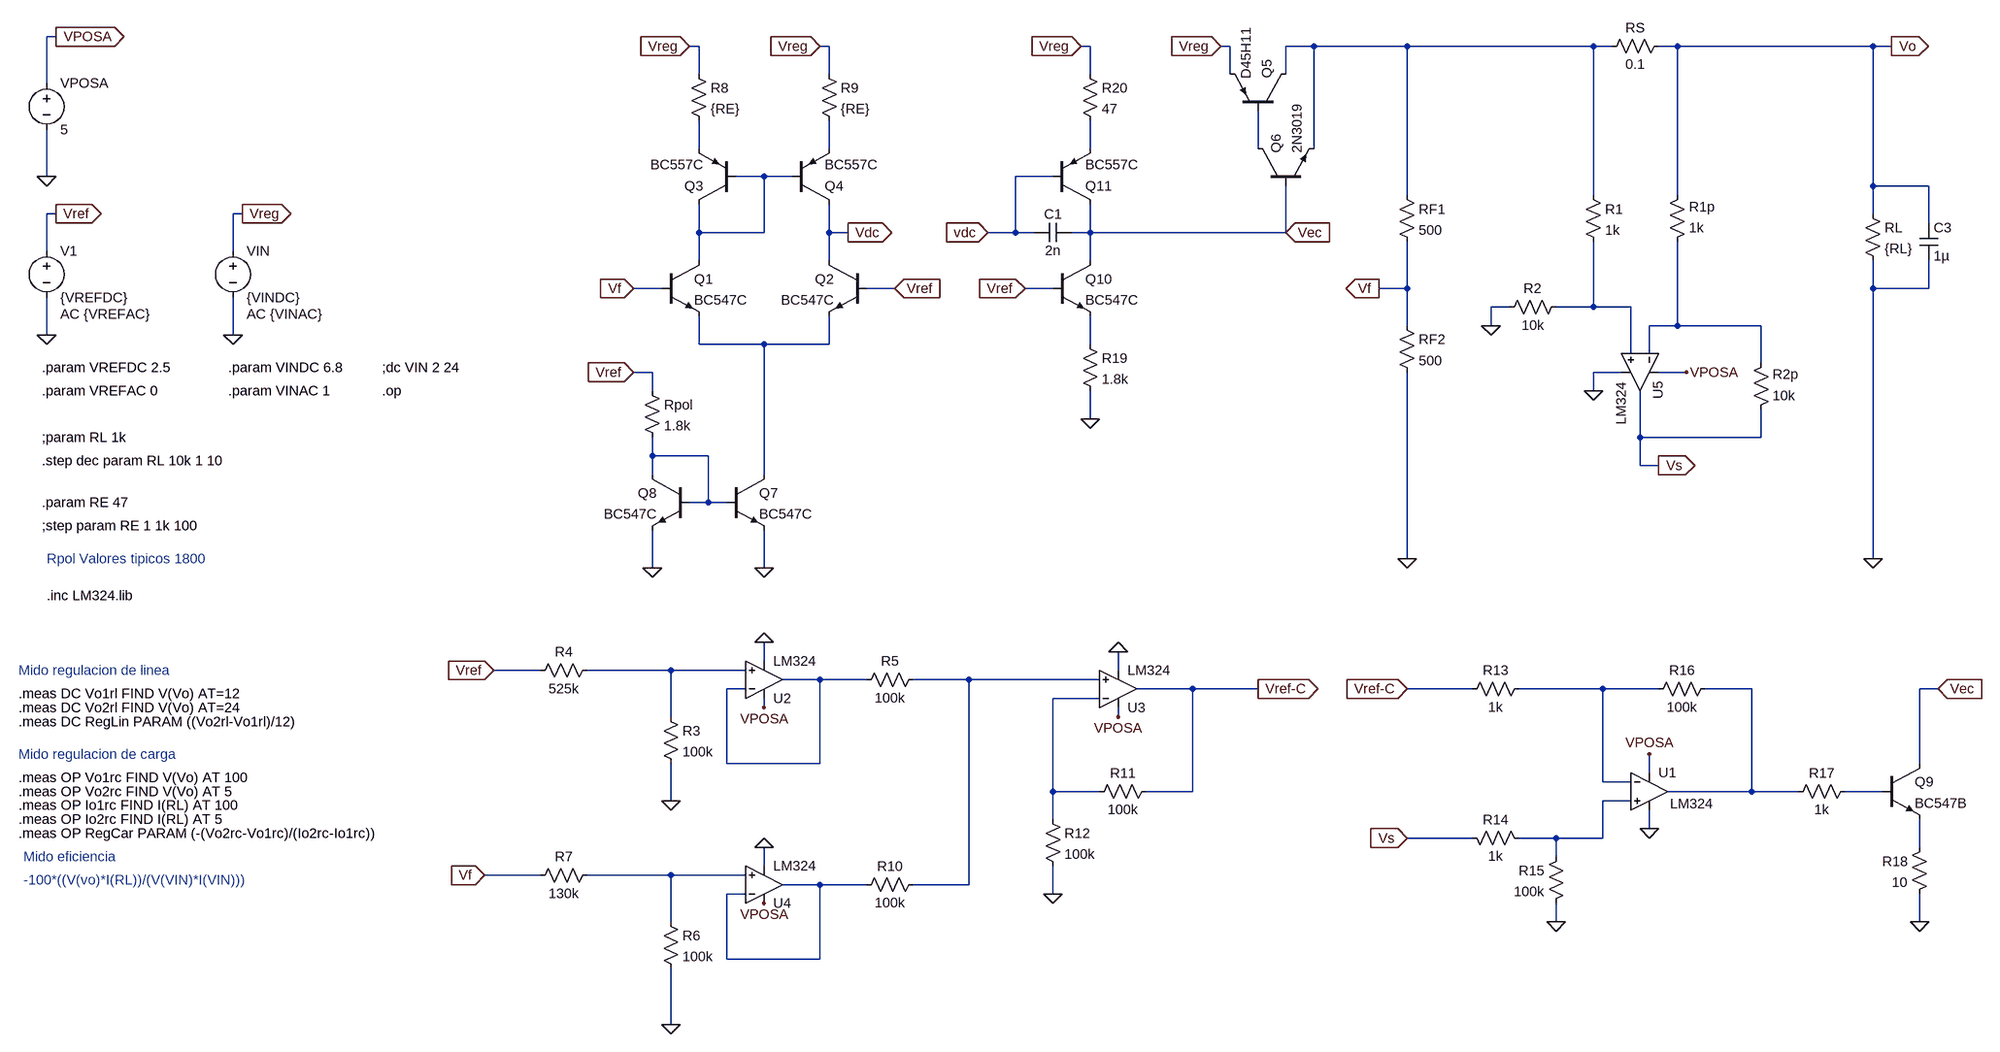
[diagram p0: schematic Version 3.5.asc]
Version 3.5.asc, the LTspice schematic file:
Version 4
SHEET 1 3148 2132
WIRE -1008 -144 -1024 -144
WIRE 96 -128 80 -128
WIRE 320 -128 304 -128
WIRE 768 -128 752 -128
WIRE 1008 -128 992 -128
WIRE 1152 -128 1104 -128
WIRE 1312 -128 1152 -128
WIRE 1632 -128 1312 -128
WIRE 1664 -128 1632 -128
WIRE 1776 -128 1744 -128
WIRE 2112 -128 1776 -128
WIRE 2144 -128 2112 -128
WIRE 96 -80 96 -128
WIRE 320 -80 320 -128
WIRE 768 -80 768 -128
WIRE 1008 -80 1008 -128
WIRE 1104 -80 1104 -128
WIRE -1024 -64 -1024 -144
WIRE 96 48 96 0
WIRE 320 48 320 0
WIRE 768 48 768 0
WIRE 1056 48 1056 -16
WIRE 1152 48 1152 -128
WIRE -1024 96 -1024 16
WIRE 208 96 160 96
WIRE 256 96 208 96
WIRE 704 96 640 96
WIRE 2112 112 2112 -128
WIRE 2208 112 2112 112
WIRE 1312 128 1312 -128
WIRE 1632 128 1632 -128
WIRE 1776 128 1776 -128
WIRE -1008 160 -1024 160
WIRE -688 160 -704 160
WIRE 2112 160 2112 112
WIRE 2208 176 2208 112
WIRE 96 192 96 144
WIRE 208 192 208 96
WIRE 208 192 96 192
WIRE 320 192 320 144
WIRE 352 192 320 192
WIRE 640 192 640 96
WIRE 640 192 592 192
WIRE 672 192 640 192
WIRE 768 192 768 144
WIRE 768 192 736 192
WIRE 1104 192 1104 112
WIRE 1104 192 768 192
WIRE -1024 224 -1024 160
WIRE -704 224 -704 160
WIRE 96 240 96 192
WIRE 320 240 320 192
WIRE 768 240 768 192
WIRE 32 288 -16 288
WIRE 432 288 384 288
WIRE 704 288 656 288
WIRE 1312 288 1312 208
WIRE 1312 288 1264 288
WIRE 2112 288 2112 240
WIRE 2208 288 2208 240
WIRE 2208 288 2112 288
WIRE 1488 320 1456 320
WIRE 1632 320 1632 208
WIRE 1632 320 1568 320
WIRE 1696 320 1632 320
WIRE 1312 352 1312 288
WIRE 1456 352 1456 320
WIRE 1776 352 1776 208
WIRE 1776 352 1728 352
WIRE 1920 352 1776 352
WIRE -1024 368 -1024 304
WIRE -704 368 -704 304
WIRE 96 384 96 336
WIRE 208 384 96 384
WIRE 320 384 320 336
WIRE 320 384 208 384
WIRE 768 384 768 336
WIRE 1696 400 1696 320
WIRE 1728 400 1728 352
WIRE 1920 416 1920 352
WIRE 16 432 -16 432
WIRE 1680 432 1632 432
WIRE 1792 432 1744 432
WIRE 16 464 16 432
WIRE 1632 464 1632 432
WIRE 768 512 768 464
WIRE 1712 544 1712 464
WIRE 1920 544 1920 496
WIRE 1920 544 1712 544
WIRE 16 576 16 544
WIRE 112 576 16 576
WIRE 1712 592 1712 544
WIRE 1744 592 1712 592
WIRE 16 608 16 576
WIRE 208 608 208 384
WIRE 112 656 112 576
WIRE 112 656 80 656
WIRE 144 656 112 656
WIRE 1312 752 1312 432
WIRE 2112 752 2112 288
WIRE 16 768 16 704
WIRE 208 768 208 704
WIRE 208 928 208 896
WIRE -176 944 -256 944
WIRE 48 944 -96 944
WIRE 176 944 48 944
WIRE 816 944 816 912
WIRE 304 960 240 960
WIRE 384 960 304 960
WIRE 560 960 464 960
WIRE 784 960 560 960
WIRE 176 976 144 976
WIRE 944 976 848 976
WIRE 1056 976 944 976
WIRE 1424 976 1312 976
WIRE 1648 976 1504 976
WIRE 1744 976 1648 976
WIRE 1904 976 1824 976
WIRE 2224 976 2192 976
WIRE 784 992 704 992
WIRE 208 1008 208 992
WIRE 48 1024 48 944
WIRE 816 1024 816 1008
WIRE 144 1104 144 976
WIRE 304 1104 304 960
WIRE 304 1104 144 1104
WIRE 2192 1104 2192 976
WIRE 1728 1120 1728 1088
WIRE 1648 1136 1648 976
WIRE 1696 1136 1648 1136
WIRE 704 1152 704 992
WIRE 784 1152 704 1152
WIRE 944 1152 944 976
WIRE 944 1152 864 1152
WIRE 1904 1152 1904 976
WIRE 1904 1152 1760 1152
WIRE 1984 1152 1904 1152
WIRE 2128 1152 2064 1152
WIRE 48 1168 48 1104
WIRE 1696 1168 1648 1168
WIRE 704 1200 704 1152
WIRE 1728 1216 1728 1184
WIRE 1424 1232 1312 1232
WIRE 1568 1232 1504 1232
WIRE 1648 1232 1648 1168
WIRE 1648 1232 1568 1232
WIRE 2192 1248 2192 1200
WIRE 1568 1264 1568 1232
WIRE 208 1280 208 1248
WIRE -176 1296 -272 1296
WIRE 48 1296 -96 1296
WIRE 176 1296 48 1296
WIRE 304 1312 240 1312
WIRE 384 1312 304 1312
WIRE 560 1312 560 960
WIRE 560 1312 464 1312
WIRE 176 1328 144 1328
WIRE 704 1328 704 1280
WIRE 48 1376 48 1296
WIRE 1568 1376 1568 1344
WIRE 2192 1376 2192 1328
WIRE 144 1440 144 1328
WIRE 304 1440 304 1312
WIRE 304 1440 144 1440
WIRE 48 1552 48 1456
FLAG 2144 -128 Vo
IOPIN 2144 -128 Out
FLAG -1008 160 Vref
IOPIN -1008 160 Out
FLAG -1024 368 0
FLAG -688 160 Vreg
IOPIN -688 160 Out
FLAG 2112 752 0
FLAG 1312 752 0
FLAG 432 288 Vref
IOPIN 432 288 In
FLAG -16 432 Vref
IOPIN -16 432 In
FLAG -704 368 0
FLAG 16 768 0
FLAG 208 768 0
FLAG 80 -128 Vreg
IOPIN 80 -128 In
FLAG 304 -128 Vreg
IOPIN 304 -128 In
FLAG 992 -128 Vreg
IOPIN 992 -128 In
FLAG 1568 1376 0
FLAG 2192 1376 0
FLAG 48 1168 0
FLAG 48 1552 0
FLAG 704 1328 0
FLAG 208 1008 VPOSA
FLAG 816 1024 VPOSA
FLAG 1728 1088 VPOSA
FLAG 208 1344 VPOSA
FLAG 208 1248 0
FLAG 208 896 0
FLAG 816 912 0
FLAG 1728 1216 0
FLAG -272 1296 Vf
IOPIN -272 1296 In
FLAG -256 944 Vref
IOPIN -256 944 In
FLAG 1312 976 Vref-C
IOPIN 1312 976 In
FLAG 1312 1232 Vs
IOPIN 1312 1232 In
FLAG 1056 976 Vref-C
IOPIN 1056 976 Out
FLAG 1792 432 VPOSA
FLAG 1456 352 0
FLAG 1632 464 0
FLAG 1744 592 Vs
IOPIN 1744 592 Out
FLAG -1024 96 0
FLAG -1008 -144 VPOSA
IOPIN -1008 -144 Out
FLAG 352 192 Vdc
IOPIN 352 192 Out
FLAG 2224 976 Vec
IOPIN 2224 976 In
FLAG 1264 288 Vf
IOPIN 1264 288 Out
FLAG -16 288 Vf
IOPIN -16 288 In
FLAG 752 -128 Vreg
IOPIN 752 -128 In
FLAG 656 288 Vref
IOPIN 656 288 In
FLAG 768 512 0
FLAG 592 192 vdc
IOPIN 592 192 In
FLAG 1104 192 Vec
IOPIN 1104 192 In
DATAFLAG 16 288 ""
DATAFLAG 112 192 ""
DATAFLAG 224 96 ""
DATAFLAG 320 32 ""
DATAFLAG 768 -128 ""
DATAFLAG 800 192 ""
DATAFLAG 768 16 ""
SYMBOL pnp 160 144 R180
SYMATTR InstName Q3
SYMATTR Value BC557C
SYMBOL pnp 256 144 M180
SYMATTR InstName Q4
SYMATTR Value BC557C
SYMBOL npn 32 240 R0
SYMATTR InstName Q1
SYMATTR Value BC547C
SYMBOL npn 384 240 M0
SYMATTR InstName Q2
SYMATTR Value BC547C
SYMBOL pnp 1104 -16 M270
SYMATTR InstName Q5
SYMATTR Value D45H11
SYMBOL npn 1056 112 R270
SYMATTR InstName Q6
SYMATTR Value 2N3019
SYMBOL res 1296 112 R0
SYMATTR InstName RF1
SYMATTR Value 500
SYMBOL res 1296 336 R0
SYMATTR InstName RF2
SYMATTR Value 500
SYMBOL res 2096 144 R0
SYMATTR InstName RL
SYMATTR Value {RL}
SYMBOL voltage -1024 208 R0
WINDOW 123 24 124 Left 2
WINDOW 39 0 0 Left 0
SYMATTR Value2 AC {VREFAC}
SYMATTR InstName V1
SYMATTR Value {VREFDC}
SYMBOL res 80 -96 R0
SYMATTR InstName R8
SYMATTR Value {RE}
SYMBOL res 304 -96 R0
SYMATTR InstName R9
SYMATTR Value {RE}
SYMBOL cap 2192 176 R0
SYMATTR InstName C3
SYMATTR Value 1µ
SYMBOL voltage -704 208 R0
WINDOW 123 24 124 Left 2
WINDOW 39 0 0 Left 0
SYMATTR Value2 AC {VINAC}
SYMATTR InstName VIN
SYMATTR Value {VINDC}
SYMBOL npn 144 608 R0
SYMATTR InstName Q7
SYMATTR Value BC547C
SYMBOL npn 80 608 M0
SYMATTR InstName Q8
SYMATTR Value BC547C
SYMBOL res 0 448 R0
SYMATTR InstName Rpol
SYMATTR Value 1.8k
SYMBOL npn 2128 1104 R0
SYMATTR InstName Q9
SYMATTR Value BC547B
SYMBOL OpAmps\\opamp2 1728 1088 R0
WINDOW 3 36 85 Left 2
SYMATTR Value LM324
SYMATTR InstName U1
SYMBOL OpAmps\\opamp2 208 1024 M180
SYMATTR InstName U2
SYMATTR Value LM324
SYMBOL OpAmps\\opamp2 816 1040 M180
SYMATTR InstName U3
SYMATTR Value LM324
SYMBOL OpAmps\\opamp2 208 1376 M180
SYMATTR InstName U4
SYMATTR Value LM324
SYMBOL res 1760 -144 R90
WINDOW 0 0 56 VBottom 2
WINDOW 3 32 56 VTop 2
SYMATTR InstName RS
SYMATTR Value 0.1
SYMBOL OpAmps\\opamp2 1776 432 R90
SYMATTR InstName U5
SYMATTR Value LM324
SYMBOL voltage -1024 -80 R0
SYMATTR InstName VPOSA
SYMATTR Value 5
SYMBOL res 1616 112 R0
SYMATTR InstName R1
SYMATTR Value 1k
SYMBOL res 1584 304 R90
WINDOW 0 0 56 VBottom 2
WINDOW 3 32 56 VTop 2
SYMATTR InstName R2
SYMATTR Value 10k
SYMBOL res 1760 224 M180
WINDOW 0 36 76 Left 2
WINDOW 3 36 40 Left 2
SYMATTR InstName R1p
SYMATTR Value 1k
SYMBOL res 1904 512 M180
WINDOW 0 36 76 Left 2
WINDOW 3 36 40 Left 2
SYMATTR InstName R2p
SYMATTR Value 10k
SYMBOL res 32 1008 R0
SYMATTR InstName R3
SYMATTR Value 100k
SYMBOL res -80 928 R90
WINDOW 0 0 56 VBottom 2
WINDOW 3 32 56 VTop 2
SYMATTR InstName R4
SYMATTR Value 525k
SYMBOL res 480 944 R90
WINDOW 0 0 56 VBottom 2
WINDOW 3 32 56 VTop 2
SYMATTR InstName R5
SYMATTR Value 100k
SYMBOL res 32 1360 R0
SYMATTR InstName R6
SYMATTR Value 100k
SYMBOL res -80 1280 R90
WINDOW 0 0 56 VBottom 2
WINDOW 3 32 56 VTop 2
SYMATTR InstName R7
SYMATTR Value 130k
SYMBOL res 480 1296 R90
WINDOW 0 0 56 VBottom 2
WINDOW 3 32 56 VTop 2
SYMATTR InstName R10
SYMATTR Value 100k
SYMBOL res 880 1136 R90
WINDOW 0 0 56 VBottom 2
WINDOW 3 32 56 VTop 2
SYMATTR InstName R11
SYMATTR Value 100k
SYMBOL res 688 1184 R0
SYMATTR InstName R12
SYMATTR Value 100k
SYMBOL res 1408 992 R270
WINDOW 0 32 56 VTop 2
WINDOW 3 0 56 VBottom 2
SYMATTR InstName R13
SYMATTR Value 1k
SYMBOL res 1408 1216 M90
WINDOW 0 0 56 VBottom 2
WINDOW 3 32 56 VTop 2
SYMATTR InstName R14
SYMATTR Value 1k
SYMBOL res 1584 1248 M0
SYMATTR InstName R15
SYMATTR Value 100k
SYMBOL res 1728 992 R270
WINDOW 0 32 56 VTop 2
WINDOW 3 0 56 VBottom 2
SYMATTR InstName R16
SYMATTR Value 100k
SYMBOL res 1968 1168 R270
WINDOW 0 32 56 VTop 2
WINDOW 3 0 56 VBottom 2
SYMATTR InstName R17
SYMATTR Value 1k
SYMBOL res 2208 1232 M0
SYMATTR InstName R18
SYMATTR Value 10
SYMBOL cap 736 176 R90
WINDOW 0 0 32 VBottom 2
WINDOW 3 32 32 VTop 2
SYMATTR InstName C1
SYMATTR Value 2n
SYMBOL npn 704 240 R0
SYMATTR InstName Q10
SYMATTR Value BC547C
SYMBOL res 752 368 R0
SYMATTR InstName R19
SYMATTR Value 1.8k
SYMBOL res 752 -96 R0
SYMATTR InstName R20
SYMATTR Value 47
SYMBOL pnp 704 144 M180
SYMATTR InstName Q11
SYMATTR Value BC557C
TEXT -448 464 Left 2 !.op
TEXT -712 424 Left 2 !.param VINDC 6.8
TEXT -712 464 Left 2 !.param VINAC 1
TEXT -1032 424 Left 2 !.param VREFDC 2.5
TEXT -1032 464 Left 2 !.param VREFAC 0
TEXT -1032 544 Left 2 !;param RL 1k
TEXT -448 424 Left 2 !;dc VIN 2 24
TEXT -1032 696 Left 2 !;step param RE 1 1k 100
TEXT -1032 656 Left 2 !.param RE 47
TEXT -1032 584 Left 2 !.step dec param RL 10k 1 10
TEXT -1072 944 Left 2 ;Mido regulacion de linea
TEXT -1072 984 Left 2 !.meas DC Vo1rl FIND V(Vo) AT=12
TEXT -1072 1008 Left 2 !.meas DC Vo2rl FIND V(Vo) AT=24
TEXT -1072 1032 Left 2 !.meas DC RegLin PARAM ((Vo2rl-Vo1rl)/12)
TEXT -1072 1088 Left 2 ;Mido regulacion de carga
TEXT -1072 1128 Left 2 !.meas OP Vo1rc FIND V(Vo) AT 100
TEXT -1072 1152 Left 2 !.meas OP Vo2rc FIND V(Vo) AT 5
TEXT -1072 1176 Left 2 !.meas OP Io1rc FIND I(RL) AT 100
TEXT -1072 1200 Left 2 !.meas OP Io2rc FIND I(RL) AT 5
TEXT -1064 1264 Left 2 ;Mido eficiencia
TEXT -1064 1304 Left 2 ;-100*((V(vo)*I(RL))/(V(VIN)*I(VIN)))
TEXT -1072 1224 Left 2 !.meas OP RegCar PARAM (-(Vo2rc-Vo1rc)/(Io2rc-Io1rc))
TEXT -1024 752 Left 2 ;Rpol Valores tipicos 1800
TEXT -1024 816 Left 2 !.inc LM324.lib

The netlist it stands for:
* Version 3.5.asc
Q3 N006 N006 N002 0 BC557C
Q4 Vdc N006 N003 0 BC557C
Q1 N006 Vf N009 0 BC547C
Q2 Vdc Vref N009 0 BC547C
Q5 N001 N005 Vreg 0 D45H11
Q6 N005 Vec N001 0 2N3019
RF1 N001 Vf 500
RF2 Vf 0 500
RL Vo 0 {RL}
V1 Vref 0 {VREFDC} AC {VREFAC}
R8 Vreg N002 {RE}
R9 Vreg N003 {RE}
C3 Vo 0 1µ
VIN Vreg 0 {VINDC} AC {VINAC}
Q7 N009 N011 0 0 BC547C
Q8 N011 N011 0 0 BC547C
Rpol Vref N011 1.8k
Q9 Vec N018 N020 0 BC547B
XU1 N019 N015 VPOSA 0 N016 LM324  ; pins In+ In- V+ V- OUT
XU2 N012 N013 VPOSA 0 N013 LM324  ; pins In+ In- V+ V- OUT
XU3 N014 N017 VPOSA 0 Vref-C LM324  ; pins In+ In- V+ V- OUT
XU4 N021 N022 VPOSA 0 N022 LM324  ; pins In+ In- V+ V- OUT
RS Vo N001 0.1
XU5 N007 N008 VPOSA 0 Vs LM324  ; pins In+ In- V+ V- OUT
VPOSA VPOSA 0 5
R1 N001 N007 1k
R2 N007 0 10k
R1p N008 Vo 1k
R2p Vs N008 10k
R3 N012 0 100k
R4 N012 Vref 525k
R5 N014 N013 100k
R6 N021 0 100k
R7 N021 Vf 130k
R10 N014 N022 100k
R11 Vref-C N017 100k
R12 N017 0 100k
R13 Vref-C N015 1k
R14 Vs N019 1k
R15 N019 0 100k
R16 N015 N016 100k
R17 N016 N018 1k
R18 N020 0 10
C1 Vec Vdc 2n
Q10 Vec Vref N010 0 BC547C
R19 N010 0 1.8k
R20 Vreg N004 47
Q11 Vec Vdc N004 0 BC557C
.model NPN NPN
.model PNP PNP
.lib standard.bjt
.op
.param VINDC 6.8
.param VINAC 1
.param VREFDC 2.5
.param VREFAC 0
;param RL 1k
;dc VIN 2 24
;step param RE 1 1k 100
.param RE 47
.step dec param RL 10k 1 10
* Mido regulacion de linea
.meas DC Vo1rl FIND V(Vo) AT=12
.meas DC Vo2rl FIND V(Vo) AT=24
.meas DC RegLin PARAM ((Vo2rl-Vo1rl)/12)
* Mido regulacion de carga
.meas OP Vo1rc FIND V(Vo) AT 100
.meas OP Vo2rc FIND V(Vo) AT 5
.meas OP Io1rc FIND I(RL) AT 100
.meas OP Io2rc FIND I(RL) AT 5
* Mido eficiencia
* -100*((V(vo)*I(RL))/(V(VIN)*I(VIN)))
.meas OP RegCar PARAM (-(Vo2rc-Vo1rc)/(Io2rc-Io1rc))
* Rpol Valores tipicos 1800
.inc LM324.lib
.backanno
.end

* Results of the author's LTspice run, read from the files saved beside the schematic
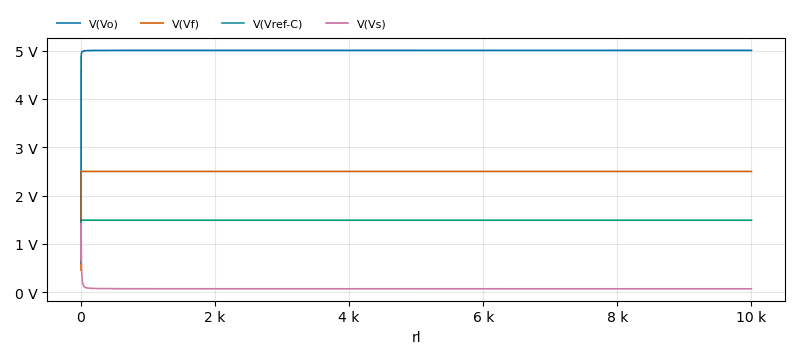
[diagram p1: Operating Point of Version 3.5.asc, plotted from the saved traces]
* Operating Point, 1 run:
*   V(Vo): 838.9 mV at rl=1 , 5.006 V at rl=10 k, min 838.9 mV, max 5.006 V
*   V(Vf): 460.9 mV at rl=1 , 2.5 V at rl=10 k, min 460.9 mV, max 2.5 V
*   V(Vref-C): 603.7 mV at rl=1 , 1.49 V at rl=10 k, min 603.7 mV, max 1.49 V
*   V(Vs): 839.7 mV at rl=1 , 70.02 mV at rl=10 k, min 70.02 mV, max 1.423 V
* From the log:
*   Semiconductor Device Operating Points:
*                           --- Diodes ---
*   Name:    d:u5:p      d:u5:ln     d:u5:lp     d:u5:e      d:u5:c
*   Model:    u5:dx       u5:dx       u5:dx       u5:dx       u5:dx
*   Id:     -5.00e-12   -4.00e-11   -4.00e-11   -2.40e-13   -2.06e-12
*   Vd:     -5.00e+00   -4.00e+01   -4.00e+01   -2.40e-01   -2.06e+00
*   Req:     1.00e+12    1.00e+12    1.00e+12    1.00e+12    1.00e+12
*   CAP:     0.00e+00    0.00e+00    0.00e+00    0.00e+00    0.00e+00
*   Name:    d:u4:p      d:u4:ln     d:u4:lp     d:u4:e      d:u4:c
*   Model:    u4:dx       u4:dx       u4:dx       u4:dx       u4:dx
*   Id:     -5.00e-12   -4.00e-11   -4.00e-11    3.90e-09   -2.70e-12
*   Vd:     -5.00e+00   -4.00e+01   -4.00e+01    3.98e-01   -2.70e+00
*   Req:     1.00e+12    1.00e+12    1.00e+12    6.63e+06    1.00e+12
*   CAP:     0.00e+00    0.00e+00    0.00e+00    0.00e+00    0.00e+00
*   Name:    d:u3:p      d:u3:ln     d:u3:lp     d:u3:e      d:u3:c
*   Model:    u3:dx       u3:dx       u3:dx       u3:dx       u3:dx
*   Id:     -5.00e-12   -4.00e-11   -4.00e-11   -3.81e-15   -2.30e-12
*   Vd:     -5.00e+00   -4.00e+01   -4.00e+01   -3.70e-03   -2.30e+00
*   Req:     1.00e+12    1.00e+12    1.00e+12    9.74e+11    1.00e+12
*   CAP:     0.00e+00    0.00e+00    0.00e+00    0.00e+00    0.00e+00
*   Name:    d:u2:p      d:u2:ln     d:u2:lp     d:u2:e      d:u2:c
*   Model:    u2:dx       u2:dx       u2:dx       u2:dx       u2:dx
*   Id:     -5.00e-12   -4.00e-11   -4.00e-11    1.90e-12   -2.50e-12
*   Vd:     -5.00e+00   -4.00e+01   -4.00e+01    1.98e-01   -2.50e+00
*   Req:     1.00e+12    1.00e+12    1.00e+12    1.50e+10    1.00e+12
*   CAP:     0.00e+00    0.00e+00    0.00e+00    0.00e+00    0.00e+00
*   Name:    d:u1:p      d:u1:ln     d:u1:lp     d:u1:e      d:u1:c
*   Model:    u1:dx       u1:dx       u1:dx       u1:dx       u1:dx
*   Id:     -5.00e-12   -4.14e-11   -3.86e-11   -2.90e-12    7.99e-06
*   Vd:     -5.00e+00   -4.14e+01   -3.86e+01   -2.90e+00    5.96e-01
*   Req:     1.00e+12    1.00e+12    1.00e+12    1.00e+12    3.24e+03
*   CAP:     0.00e+00    0.00e+00    0.00e+00    0.00e+00    0.00e+00
*                           --- Bipolar Transistors ---
*   Name:     q:u5:2      q:u5:1      q:u4:2      q:u4:1      q:u3:2
*   Model:     u5:qx       u5:qx       u4:qx       u4:qx       u3:qx
*   Ib:      -2.01e-08   -2.01e-08   -2.02e-08   -2.01e-08   -2.02e-08
*   Ic:      -5.03e-06   -5.02e-06   -5.05e-06   -5.03e-06   -5.05e-06
*   Vbe:     -5.84e-01   -5.84e-01   -5.84e-01   -5.84e-01   -5.84e-01
*   Vbc:      7.99e-01    7.99e-01    1.61e-01    1.62e-01    2.63e-01
*   Vce:     -1.38e+00   -1.38e+00   -7.45e-01   -7.45e-01   -8.46e-01
*   BetaDC:   2.50e+02    2.50e+02    2.50e+02    2.50e+02    2.50e+02
*   Gm:       1.95e-04    1.94e-04    1.95e-04    1.95e-04    1.95e-04
*   Rpi:      1.29e+06    1.29e+06    1.28e+06    1.28e+06    1.28e+06
*   Rx:       0.00e+00    0.00e+00    0.00e+00    0.00e+00    0.00e+00
*   Ro:       8.37e+26    8.42e+26    1.65e+16    1.67e+16    8.29e+17
*   Cbe:      0.00e+00    0.00e+00    0.00e+00    0.00e+00    0.00e+00
*   Cbc:      0.00e+00    0.00e+00    0.00e+00    0.00e+00    0.00e+00
*   Cjs:      0.00e+00    0.00e+00    0.00e+00    0.00e+00    0.00e+00
*   BetaAC:   2.50e+02    2.50e+02    2.50e+02    2.50e+02    2.50e+02
*   Cbx:      0.00e+00    0.00e+00    0.00e+00    0.00e+00    0.00e+00
*   Ft:       0.00e+00    0.00e+00    0.00e+00    0.00e+00    0.00e+00
*   Name:     q:u3:1      q:u2:2      q:u2:1      q:u1:2      q:u1:1
*   Model:     u3:qx       u2:qx       u2:qx       u1:qx       u1:qx
*   Ib:      -2.01e-08   -2.02e-08   -2.01e-08   -5.35e-11   -4.02e-08
*   Ic:      -5.03e-06   -5.04e-06   -5.03e-06   -1.35e-08   -1.00e-05
*   Vbe:     -5.84e-01   -5.84e-01   -5.84e-01   -4.30e-01   -6.01e-01
*   Vbc:      2.63e-01    3.62e-01    3.62e-01    8.31e-01    5.52e-01
*   Vce:     -8.46e-01   -9.45e-01   -9.45e-01   -1.26e+00   -1.15e+00
*   BetaDC:   2.50e+02    2.50e+02    2.50e+02    2.52e+02    2.50e+02
*   Gm:       1.95e-04    1.95e-04    1.95e-04    5.21e-07    3.88e-04
*   Rpi:      1.28e+06    1.28e+06    1.29e+06    4.79e+08    6.44e+05
*   Rx:       0.00e+00    0.00e+00    0.00e+00    0.00e+00    0.00e+00
*   Ro:       8.36e+17    3.81e+19    3.84e+19    2.93e+27    6.10e+22
*   Cbe:      0.00e+00    0.00e+00    0.00e+00    0.00e+00    0.00e+00
*   Cbc:      0.00e+00    0.00e+00    0.00e+00    0.00e+00    0.00e+00
*   Cjs:      0.00e+00    0.00e+00    0.00e+00    0.00e+00    0.00e+00
*   BetaAC:   2.50e+02    2.50e+02    2.50e+02    2.50e+02    2.50e+02
*   Cbx:      0.00e+00    0.00e+00    0.00e+00    0.00e+00    0.00e+00
*   Ft:       0.00e+00    0.00e+00    0.00e+00    0.00e+00    0.00e+00
*   Name:       q9          q6          q5          q10         q8
*   Model:    bc547b      2n3019      d45h11      bc547c      bc547c
*   Ib:       1.32e-03    4.37e-05   -9.04e-03    4.40e-02    2.30e-06
*   Ic:       1.31e-01    9.04e-03   -8.31e-01   -4.31e-02    1.04e-03
*   Vbe:      8.48e-01    7.03e-01   -5.19e-01    8.24e-01    6.23e-01
*   Vbc:      5.49e-01   -4.66e+00    5.36e+00    8.74e-01    0.00e+00
*   Vce:      2.99e-01    5.36e+00   -5.88e+00   -4.98e-02    6.23e-01
*   BetaDC:   9.94e+01    2.07e+02    9.19e+01   -9.79e-01    4.52e+02
*   Gm:       3.34e+00    3.46e-01    3.58e+01    4.50e-02    3.94e-02
*   Rpi:      2.73e+01    5.92e+02    2.43e+00    2.74e+01    1.14e+04
*   Rx:       1.00e+00    1.00e+01    2.04e+00    1.00e+00    1.00e+00
*   Ro:       1.53e+01    1.16e+04    1.90e+01    1.96e-01    5.06e+04
*   Cbe:      5.20e-08    3.47e-10    1.43e-07    1.13e-07    5.05e-11
*   Cbc:      3.44e-11    7.86e-12    2.14e-10    2.23e-11    2.74e-12
*   Cjs:      0.00e+00    0.00e+00    0.00e+00    0.00e+00    0.00e+00
*   BetaAC:   9.11e+01    2.05e+02    8.70e+01    1.23e+00    4.49e+02
*   Cbx:      2.12e-11    0.00e+00    5.25e-11    1.45e-11    1.69e-12
*   Ft:       1.02e+07    1.55e+08    3.98e+07    3.71e+04    1.14e+08
*   Name:       q7          q2          q1          q11         q4
*   Model:    bc547c      bc547c      bc547c      bc557c      bc557c
*   Ib:       2.29e-06    6.32e-04   -7.60e-12   -4.30e-04    4.57e-12
*   Ic:       1.06e-03    4.30e-04    6.23e-12   -8.82e-02   -1.74e-11
*   Vbe:      6.23e-01    6.73e-01   -1.37e+00   -8.07e-01   -1.36e-01
*   Vbc:     -1.20e+00    6.73e-01   -6.20e+00    2.01e-01    4.84e+00
*   Vce:      1.83e+00   -4.39e-04    4.84e+00   -1.01e+00   -4.97e+00
*   BetaDC:   4.63e+02    6.81e-01   -8.20e-01    2.05e+02   -3.82e+00
*   Gm:       4.03e-02    3.87e-02    3.87e-35    2.16e+00    4.79e-10
*   Rpi:      1.14e+04    1.73e+03    1.00e+12    6.08e+01    1.59e+11
*   Rx:       1.00e+00    1.00e+00    1.00e+00    1.00e+00    1.00e+00
*   Ro:       5.06e+04    5.04e+00    0.00e+00    2.64e+02    2.42e+12
*   Cbe:      5.09e-11    1.46e-10    8.09e-12    4.57e-09    1.47e-11
*   Cbc:      1.59e-12    1.90e-11    1.04e-12    4.43e-12    1.78e-12
*   Cjs:      0.00e+00    0.00e+00    0.00e+00    0.00e+00    0.00e+00
*   BetaAC:   4.60e+02    6.70e+01    3.87e-23    1.31e+02    7.62e+01
*   Cbx:      9.78e-13    1.17e-11    6.41e-13    2.62e-12    1.05e-12
*   Ft:       1.20e+08    3.48e+07    1.63e-02    7.51e+07    4.34e+00
*   Name:       q3
*   Model:    bc557c
*   Ib:      -3.15e-13
*   Ic:      -1.05e-11
*   Vbe:     -1.36e-01
*   Vbc:      0.00e+00
*   Vce:     -1.36e-01
*   BetaDC:   3.33e+01
*   Gm:       4.00e-10
*   Rpi:      1.59e+11
*   Rx:       1.00e+00
*   Ro:       3.84e+11
*   Cbe:      1.47e-11
*   Cbc:      4.90e-12
*   Cjs:      0.00e+00
*   BetaAC:   6.37e+01
*   Cbx:      2.90e-12
*   Ft:       2.83e+00
*   vo1rc: v(vo)=5.00085 at 100
*   vo2rc: v(vo)=4.90762 at 5
*   io1rc: i(rl)=0.0500085 at 100
*   io2rc: i(rl)=0.982105 at 5
*   regcar: (-(vo2rc-vo1rc)/(io2rc-io1rc))=0.10002